# Altium schematic sheet motor_controller.SchDoc
size A4; DrawnBy: Van Tuan Ngo; Organization: PIF Club; Address1: 304B1, HCMUT,; Address2: Ly Thuong Kiet St.,; Address3: District 10, HCM, VN; DocumentNumber: 2; Revision: 1.0.0; SheetNumber: 2; SheetTotal: 8; Project: PIFWRobot
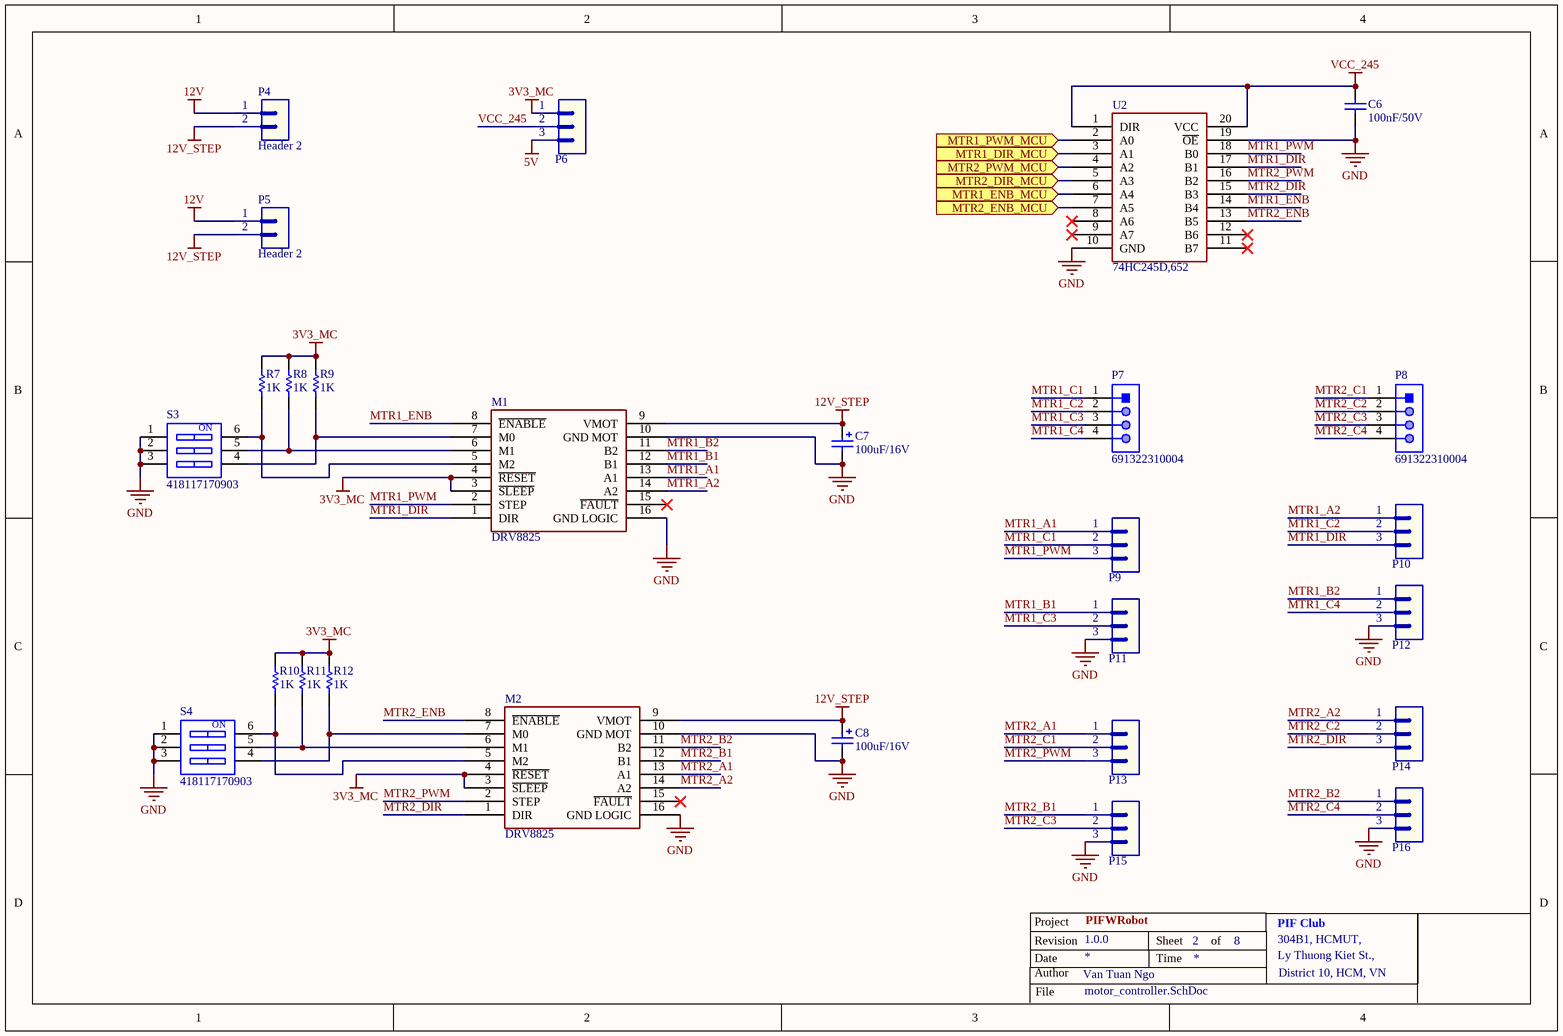
[diagram p0: motor_controller.SchDoc]

## Parts
C6  value 100nF/50V  [CAP-SM-0805]  (hidden comment: Cap-100nF-50V-0805)
C7  value 100uF/16V  [CAP-SM-AL-SIZE-D-D6L6]  (hidden comment: Cap-Al-100uF-16V-D6L5)
C8  value 100uF/16V  [CAP-SM-AL-SIZE-D-D6L6]  (hidden comment: Cap-Al-100uF-16V-D6L5)
M1  DRV8825  [DRV8825]
M2  DRV8825  [DRV8825]
P4  Header 2  [JP2]
P5  Header 2  [JP2]
P6  Header 3  [JP3]  (value not drawn)
P7  691322310004  [691322310004]
P8  691322310004  [691322310004]
P9  Header 3  [JP3]  (value not drawn)
P10  Header 3  [JP3]  (value not drawn)
P11  Header 3  [JP3]  (value not drawn)
P12  Header 3  [JP3]  (value not drawn)
P13  Header 3  [JP3]  (value not drawn)
P14  Header 3  [JP3]  (value not drawn)
P15  Header 3  [JP3]  (value not drawn)
P16  Header 3  [JP3]  (value not drawn)
R7  value 1K  [RES-SM-0805]  (hidden comment: Res-1K-0805)
R8  value 1K  [RES-SM-0805]  (hidden comment: Res-1K-0805)
R9  value 1K  [RES-SM-0805]  (hidden comment: Res-1K-0805)
R10  value 1K  [RES-SM-0805]  (hidden comment: Res-1K-0805)
R11  value 1K  [RES-SM-0805]  (hidden comment: Res-1K-0805)
R12  value 1K  [RES-SM-0805]  (hidden comment: Res-1K-0805)
S3  418117170903  [418117170903]
S4  418117170903  [418117170903]
U2  74HC245D,652  [SOT163-1_NEX]

## Ports
MTR1_DIR_MCU (in), MTR1_ENB_MCU (in), MTR1_PWM_MCU (in), MTR2_DIR_MCU (in), MTR2_ENB_MCU (in), MTR2_PWM_MCU (in)

## Nets
3V3_MC: M1.3(~{SLEEP}) M1.4(~{RESET}) M2.3(~{SLEEP}) M2.4(~{RESET}) P6.1 R7.2 R8.2 R9.2 R10.2 R11.2 R12.2
5V: P6.3
12V: P4.1 P5.1
12V_STEP: C7.1 C8.1 M1.9(VMOT) M2.9(VMOT) P4.2 P5.2
GND: C6.1 C7.2 C8.2 M1.10(GND_MOT) M1.16(GND_LOGIC) M2.10(GND_MOT) M2.16(GND_LOGIC) P11.3 P12.3 P15.3 P16.3 S3.1 S3.2 S3.3 S4.1 S4.2 S4.3 U2.10(GND) U2.19(~{OE})
VCC_245: C6.2 P6.2 U2.1(DIR) U2.20(VCC)
MTR1_A1: M1.13(A1) P9.1
MTR1_A2: M1.14(A2) P10.1
MTR1_B1: M1.12(B1) P11.1
MTR1_B2: M1.11(B2) P12.1
MTR1_C1: P7.1 P9.2
MTR1_C2: P7.2 P10.2
MTR1_C3: P7.3 P11.2
MTR1_C4: P7.4 P12.2
MTR1_DIR: M1.1(DIR) P10.3 U2.17(B1)
MTR1_DIR_MCU: U2.3(A1) ; port MTR1_DIR_MCU
MTR1_ENB: M1.8(~{ENABLE}) U2.14(B4)
MTR1_ENB_MCU: U2.6(A4) ; port MTR1_ENB_MCU
MTR1_PWM: M1.2(STEP) P9.3 U2.18(B0)
MTR1_PWM_MCU: U2.2(A0) ; port MTR1_PWM_MCU
MTR2_A1: M2.13(A1) P13.1
MTR2_A2: M2.14(A2) P14.1
MTR2_B1: M2.12(B1) P15.1
MTR2_B2: M2.11(B2) P16.1
MTR2_C1: P8.1 P13.2
MTR2_C2: P8.2 P14.2
MTR2_C3: P8.3 P15.2
MTR2_C4: P8.4 P16.2
MTR2_DIR: M2.1(DIR) P14.3 U2.15(B3)
MTR2_DIR_MCU: U2.5(A3) ; port MTR2_DIR_MCU
MTR2_ENB: M2.8(~{ENABLE}) U2.13(B5)
MTR2_ENB_MCU: U2.7(A5) ; port MTR2_ENB_MCU
MTR2_PWM: M2.2(STEP) P13.3 U2.16(B2)
MTR2_PWM_MCU: U2.4(A2) ; port MTR2_PWM_MCU
NetM1_5: M1.5(M2) R7.1 S3.6
NetM1_6: M1.6(M1) R8.1 S3.5
NetM1_7: M1.7(M0) R9.1 S3.4
NetM2_5: M2.5(M2) R10.1 S4.6
NetM2_6: M2.6(M1) R11.1 S4.5
NetM2_7: M2.7(M0) R12.1 S4.4

Not connected (* = marked no-connect by the designer): M1 15(~{FAULT})*; M2 15(~{FAULT})*; U2 8(A6)* 9(A7)* 11(B7)* 12(B6)*

## Notes on the sheet
- Project
- Revision
- Date
- Author
- Sheet
- Time
- of
- File
- (in symbol 418117170903) ON

## Library data of the parts
C6 = Cap-100nF-50V-0805: CAP CER 0.1UF 50V Y5V 0805; Manufacturer: Samsung Electro-Mechanics; Manufacturer Part Number: CL21F104ZBCNNNC; Local Supplier: thegioiic; Local Supplier Link: https://thegioiic.com/products/tu-100nf-0-1uf-50v-0805; Supplier 1: Digikey; Supplier 1 Part Number: 1276-1007-1-ND; Supplier 1 Link: https://www.digikey.com/product-detail/en/samsung-electro-mechanics/CL21F104ZBCNNNC/1276-1007-1-ND/3889093
C7 C8 = Cap-Al-100uF-16V-D6L5: CAP ALUM 100UF 20% 16V SMD; Manufacturer: Nichicon; Manufacturer Part Number: UWX1C101MCL1GB; Local Supplier: thegioiic; Local Supplier Link: https://www.thegioiic.com/products/tu-nhom-smd-100uf-16v-6-3x5-4mm; Supplier 1: Digikey; Supplier 1 Part Number: 493-2105-1-ND; Supplier 1 Link: https://www.digikey.com/product-detail/en/nichicon/UWX1C101MCL1GB/493-2105-1-ND/590080
P4 P5 = Header 2: Header, 2-Pin; LatestRevisionDate: 17-Jul-2002; LatestRevisionNote: Re-released for DXP Platform.; Publisher: Altium Limited; Local Supplier: thegioiic; Local Supplier Part Number: x; Local Supplier Link: https://www.thegioiic.com/products/hang-rao-duc-don-2-54mm-40-chan-1-hang-cao-11-4mm-xuyen-lo
P6 P9-P16 = Header 3: Header, 3-Pin; LatestRevisionDate: 17-Jul-2002; LatestRevisionNote: Re-released for DXP Platform.; Publisher: Altium Limited; Local Supplier: thegioiic; Local Supplier Part Number: x; Local Supplier Link: https://www.thegioiic.com/products/hang-rao-duc-don-2-54mm-40-chan-1-hang-cao-11-4mm-xuyen-lo
P7 P8 = 691322310004: WR-TBL Serie 322 Horizontal PCB Header, Pluggable, pitch 3.81mm, 4p; Local Suplier Part Number: x; Compliance: RoHS; Modularity: No; Pin Number: 4; Rated Current [UL]: 10A; Working Voltage [UL]: 300VAC; ComponentLink1Description: Manufacturer; ComponentLink1URL: http://www.we-online.de; ComponentLink2URL: https://katalog.we-online.de/em/datasheet/691322310004.pdf; ComponentLink2Description: Datasheet; Mounting Technology: THT; Part Number: 691322310004; Packaging: Box; Operating Temperature: -40 to +105degC; PCB/Cable/Panel: PCB; Pitch: 3.81mm; Published Date: October 2019; Type: Horizontal; Publisher: Wurth Elektronik; Application: Pluggable; Local Supplier: thegioiic; Local Supplier Link: https://www.thegioiic.com/products/ul-3-81-4-r-terminal-block-plug-in-han-pcb-4-chan-cong-3-81mm-ulo
R7-R12 = Res-1K-0805: RES 1K OHM 1% 1/4W 0805; Manufacturer: Stackpole Electronics Inc; Manufacturer Part Number: RNCP0805FTD1K00; Local Supplier: thegioiic; Local Supplier Link: https://www.thegioiic.com/products/dien-tro-1-kohm-0805-5; Supplier 1: Digikey; Supplier 1 Link: https://www.digikey.com/product-detail/en/stackpole-electronics-inc/RNCP0805FTD1K00/RNCP0805FTD1K00CT-ND/2240568; Supplier 1 Part Number: RNCP0805FTD1K00CT-ND
S3 S4 = 418117170903: WS-DITV Compact THT Dip Switch, Flat Actuator, pitch 2.54mm, 3p; Operation Force: 800g; Pole Number: 3; Actuator Type: Flat Type; Circuit: SPST-NO; Rated Current Switching: 25mA; Rated Current Non-Switching: 100mA; Rated Voltage Non-Switching: 50VDC; Rated Voltage Switching: 24VDC; ComponentLink1Description: Manufacturer; ComponentLink1URL: http://www.we-online.de; ComponentLink2Description: Datasheet; ComponentLink2URL: https://katalog.we-online.com/em/datasheet/418117170903.pdf; Pitch: 2.54mm; Contact Material: Copper Alloy; Mounting Technology: THT; Operating Temperature: -40 to +85degC; Contact Plating: Gold; Packaging: Tube; Part Number: 418117170903; Publisher: Wurth Elektronik; Published Date: September 2019; Local Supplier: thegioiic; Local Supplier Part Number: x; Local Supplier Link: https://www.thegioiic.com/products/cong-tac-3-bit-dip-switch-xuyen-lo-2-54mm-mau-do
U2 = 74HC245D,652: Vendor: Nexperia; SourceLibrary: Nexperia_2018-05-2018; Manufacturer_Part_Number: 74HC245D,652; Copyright: Copyright (C) 2016 Accelerated Designs. All rights reserved; RefDes: RefDes; Type: DEV; Local Supplier: thegioiic; Local Supplier Part number: *; Local Supplier Link: https://www.thegioiic.com/products/74hc245d
M1 M2 = DRV8825: Local Supplier: thegioiic; Local Supplier Link: https://www.thegioiic.com/products/stepstick-drv8825-mach-dieu-khien-dong-co-buoc; Local Supplier Part Number: *